# Altium schematic sheet MODE-SELECTOR.SchDoc: Mode Selector
size A4; Author: João Guimarães; Organization: Altium Limited; Address1: L3, 12a Rodborough Rd; Address2: Frenchs Forest; Address3: NSW; Address4: Australia 2086; Revision: 1.0; SheetNumber: 5; SheetTotal: 7
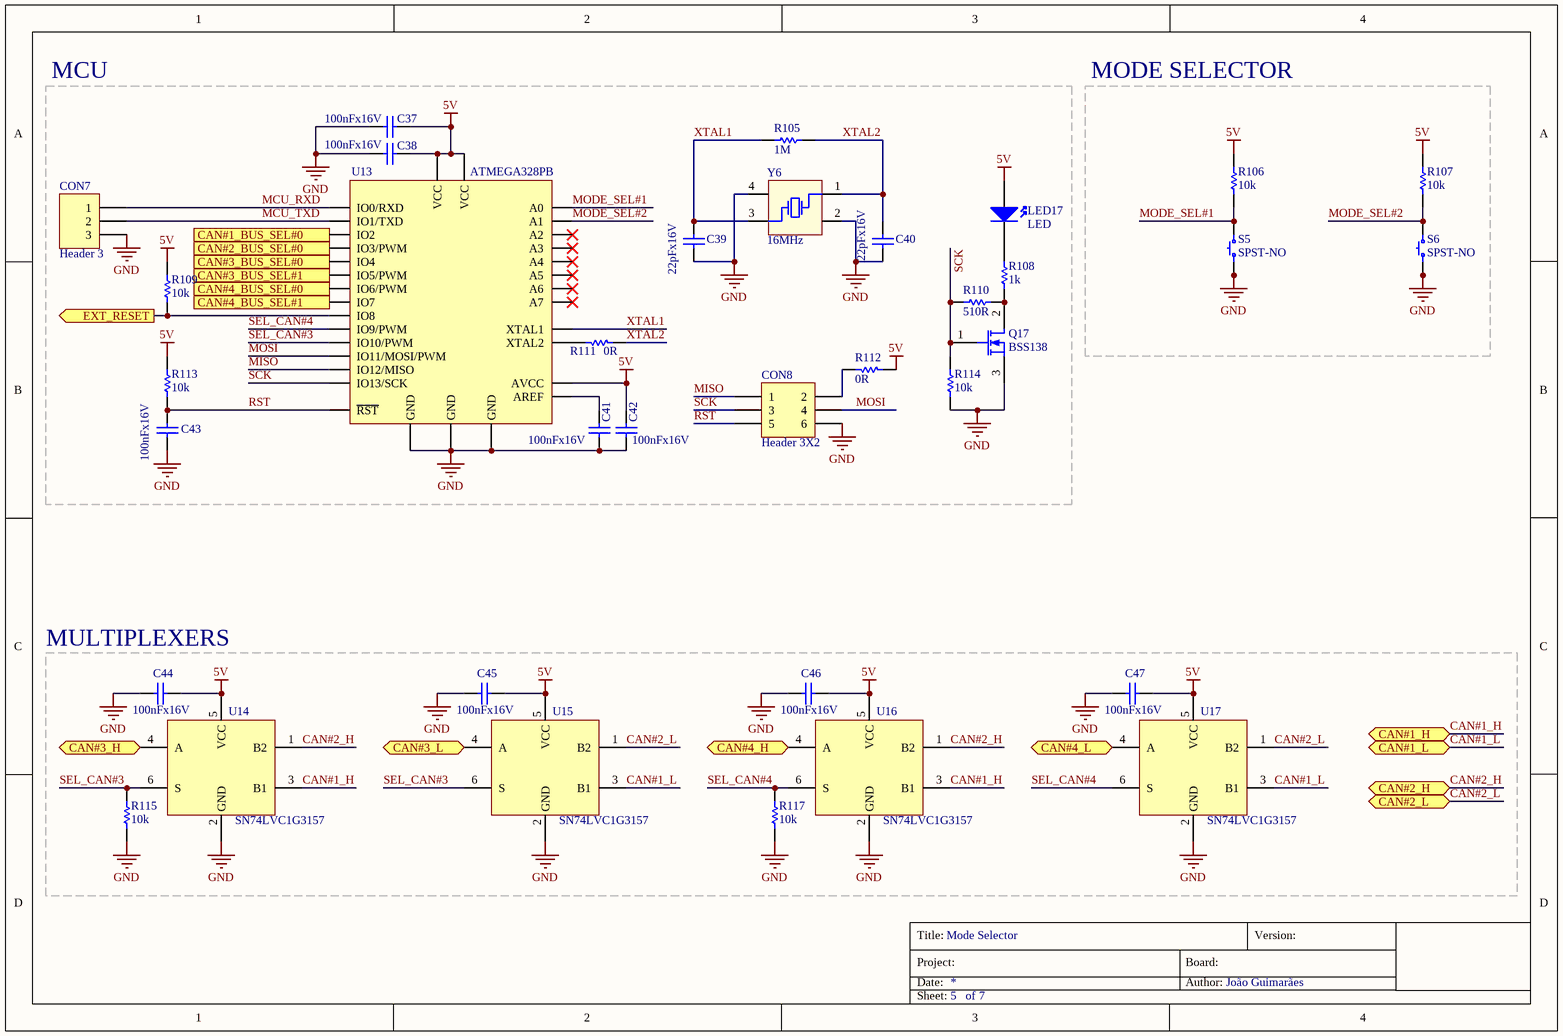
[diagram p0: MODE-SELECTOR.SchDoc]

## Parts
C37  100nFx16V  [DISC-0603]
C38  100nFx16V  [DISC-0603]
C39  22pFx16V  [DISC-0603]
C40  22pFx16V  [DISC-0603]
C41  100nFx16V  [DISC-0603]
C42  100nFx16V  [DISC-0603]
C43  100nFx16V  [DISC-0603]
C44  100nFx16V  [DISC-0603]
C45  100nFx16V  [DISC-0603]
C46  100nFx16V  [DISC-0603]
C47  100nFx16V  [DISC-0603]
CON7  Header 3  [CON-HEADER-1X3-PTH]
CON8  Header 3X2  [CON-HEADER-2X3-SMD]
LED17  LED  [DISC-LED-1206]
Q17  BSS138  [DISC-SOT-23]
R105  1M  [DISC-0603]
R106  10k  [DISC-0603]
R107  10k  [DISC-0603]
R108  1k  [DISC-0603]
R109  10k  [DISC-0603]
R110  510R  [DISC-0603]
R111  0R  [DISC-0603]
R112  0R  [DISC-0603]
R113  10k  [DISC-0603]
R114  10k  [DISC-0603]
R115  10k  [DISC-0603]
R117  10k  [DISC-0603]
S5  SPST-NO  [DISC-PUSHBUTTON-4P-PTH]
S6  SPST-NO  [DISC-PUSHBUTTON-4P-PTH]
U13  ATMEGA328PB  [CI-QFP-32]
U14  SN74LVC1G3157  [CI-SOT-23-6]
U15  SN74LVC1G3157  [CI-SOT-23-6]
U16  SN74LVC1G3157  [CI-SOT-23-6]
U17  SN74LVC1G3157  [CI-SOT-23-6]
Y6  16MHz  [DISC-CRYSTAL-4P-3.2X2.5]

## Blocks framed on the sheet
MCU: C37-C43 CON7 CON8 LED17 Q17 R105 R108-R114 U13 Y6
MODE SELECTOR: R106 R107 S5 S6
MULTIPLEXERS: C44-C47 R115 R117 U14-U17

## Ports
CAN#1_BUS_SEL#0 (out), CAN#1_H (bidir), CAN#1_L (bidir), CAN#2_BUS_SEL#0 (out), CAN#2_H (bidir), CAN#2_L (bidir), CAN#3_BUS_SEL#0 (out), CAN#3_BUS_SEL#1 (out), CAN#3_H (bidir), CAN#3_L (bidir), CAN#4_BUS_SEL#0 (out), CAN#4_BUS_SEL#1 (out), CAN#4_H (bidir), CAN#4_L (bidir), EXT_RESET (out)

## Nets
5V: C37.2 C38.2 C42.1 C44.2 C45.2 C46.2 C47.2 LED17.1(A) R106.1 R107.1 R109.1 R112.2 R113.1 U13.4(VCC) U13.6(VCC) U13.18(AVCC) U14.5(VCC) U15.5(VCC) U16.5(VCC) U17.5(VCC)
GND: C37.1 C38.1 C39.1 C40.1 C41.2 C42.2 C43.2 C44.1 C45.1 C46.1 C47.1 CON7.3 CON8.6 Q17.3(S) R114.1 R115.2 R117.2 S5.1 S5.2 S6.1 S6.2 U13.3(GND) U13.5(GND) U13.21(GND) U14.2(GND) U15.2(GND) U16.2(GND) U17.2(GND) Y6.2(GND) Y6.4(GND)
CAN#1_BUS_SEL#0: U13.32(IO2) ; port CAN#1_BUS_SEL#0
CAN#1_H: U14.3(B1) U16.3(B1) ; port CAN#1_H
CAN#1_L: U15.3(B1) U17.3(B1) ; port CAN#1_L
CAN#2_BUS_SEL#0: U13.1(IO3/PWM) ; port CAN#2_BUS_SEL#0
CAN#2_H: U14.1(B2) U16.1(B2) ; port CAN#2_H
CAN#2_L: U15.1(B2) U17.1(B2) ; port CAN#2_L
CAN#3_BUS_SEL#0: U13.2(IO4) ; port CAN#3_BUS_SEL#0
CAN#3_BUS_SEL#1: U13.9(IO5/PWM) ; port CAN#3_BUS_SEL#1
CAN#3_H: U14.4(A) ; port CAN#3_H
CAN#3_L: U15.4(A) ; port CAN#3_L
CAN#4_BUS_SEL#0: U13.10(IO6/PWM) ; port CAN#4_BUS_SEL#0
CAN#4_BUS_SEL#1: U13.11(IO7) ; port CAN#4_BUS_SEL#1
CAN#4_H: U16.4(A) ; port CAN#4_H
CAN#4_L: U17.4(A) ; port CAN#4_L
EXT_RESET: R109.2 U13.12(IO8) ; port EXT_RESET
MCU_RXD: CON7.1 U13.30(IO0/RXD)
MCU_TXD: CON7.2 U13.31(IO1/TXD)
MISO: CON8.1 U13.16(IO12/MISO)
MODE_SEL#1: R106.2 S5.3 S5.4 U13.23(A0)
MODE_SEL#2: R107.2 S6.3 S6.4 U13.24(A1)
MOSI: CON8.4 U13.15(IO11/MOSI/PWM)
RST: C43.1 CON8.5 R113.2 U13.29(~{RST})
SCK: CON8.3 Q17.1(g) R110.2 R114.2 U13.17(IO13/SCK)
SEL_CAN#3: R115.1 U13.14(IO10/PWM) U14.6(S) U15.6(S)
SEL_CAN#4: R117.1 U13.13(IO9/PWM) U16.6(S) U17.6(S)
XTAL1: C39.2 R105.1 U13.7(XTAL1) Y6.3(OSC2)
XTAL2: C40.2 R105.2 R111.1 Y6.1(OSC1)
NetC41_1: C41.1 U13.20(AREF)
NetCON8_2: CON8.2 R112.1
NetLED17_2: LED17.2(K) R108.2
NetQ17_2: Q17.2(D) R108.1 R110.1
NetR111_2: R111.2 U13.8(XTAL2)

Not connected (* = marked no-connect by the designer): U13 19(A6)* 22(A7)* 25(A2)* 26(A3)* 27(A4)* 28(A5)*

## Notes on the sheet
- Title:
- Project:
- Date:
- Author:
- Board:
- Version:
- Sheet:
- of

## Library data of the parts
C37 C38 C41-C47 = Cap: Capacitor; PartNumber1: C0603C104Z3VACTU; Manufacturer1: Kemet; ClassName: ModeSelector
C39 C40 = Cap: Capacitor; PartNumber1: CC0603JPNPO0BN220; Manufacturer1: Yageo; ClassName: ModeSelector
CON7 = Header 3: Header, 3-Pin; ClassName: ModeSelector
CON8 = Header 3X2: Header, 3-Pin, Dual row; ClassName: ModeSelector
LED17 = LED: PartNumber1: BR1101W-TR; Manufacturer1: Stanley; ClassName: ModeSelector
Q17 = Transistor-NMOS(GDS): Transistor NMOS; PartNumber1: BSS138-13-F; Manufacturer1: Diodes; ClassName: ModeSelector
R105 = Res: Resistor; PartNumber1: RC0603FR-071ML; Manufacturer1: Yageo; ClassName: ModeSelector
R106 R107 R109 R113 R115 R117 = Res: Resistor; PartNumber1: RC0603FR-0710KL; Manufacturer1: Yageo; ClassName: ModeSelector
R108 = Res: PartNumber1: RC0603FR-071KL; Manufacturer1: Yageo; ClassName: ModeSelector
R110 = Res: PartNumber1: RC0603JR-070RL; Manufacturer1: Yageo; ClassName: ModeSelector
R111 R112 = Res: Resistor; PartNumber1: RC0603JR-070RL; Manufacturer1: Yageo; ClassName: ModeSelector
R114 = Res: PartNumber1: RC0603FR-0710KL; Manufacturer1: Yageo; ClassName: ModeSelector
U13 = ATMEGA328PB-AU: 8-bit AVR® RISC-based microcontroller (MCU) with picoPower® technology.; PartNumber1: ATMEGA328PB-AUR; Manufacturer1: Microchip; ClassName: ModeSelector
U14-U17 = SN74LVC1G3157DBVR: Single-Pole Double-Throw Analog Switch; Manufacturer1: Texas Instruments; ClassName: ModeSelector; PartNumber1: SN74LVC1G3157DBVR
Y6 = XTAL-4-PIN: PartNumber1: ECS-160-12-33Q-JES-TR; Manufacturer1: ECS; ClassName: ModeSelector
S5 S6 = SPST-NO: ClassName: *; PartNumber1: *; Manufacturer1: *